# Altium schematic sheet 04_Motor_Driver.SchDoc
size A4; CheckedBy: <审核日期>; Author: llm; CompanyName: 孔乙己图书店; DocumentNumber: 4; SheetNumber: 4; SheetTotal: 6; PageSetup: Record=PageOptions|CenterHorizontal=True|CenterVertical=True|PrintScale=1.00|XCorrection=1.00|YCorrection=1.00|PrintKind=0|BorderSize=5000000|LeftOffset=0|BottomOffset=0|Orientation=2|PaperLength=1000|PaperWidth=1000|Scale=100|PaperSource=7|PrintQuality=600|MediaType=1|DitherType=10|PaperKind=A4|PrintScaleMode=1; DesignDate: <设计日期>; CheckDate: <审核人员>; SheetName: 电机驱动; SheetVersion: Rev.E; SheetDescription: <图纸描述>; productName: Fly-Balance
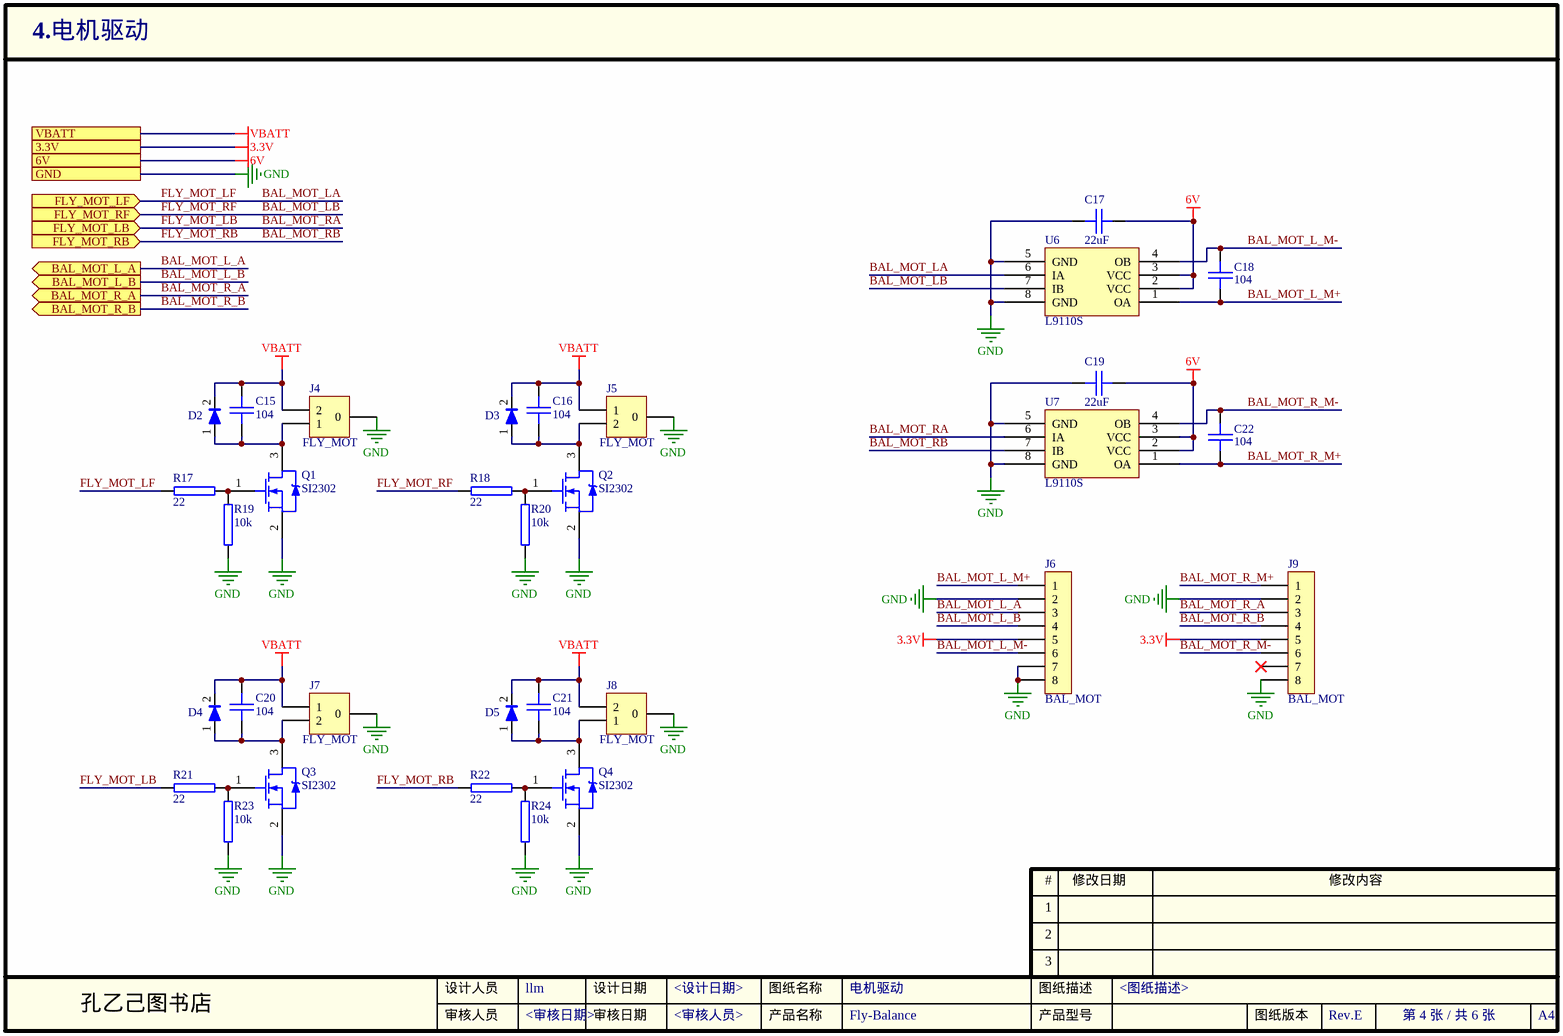
[diagram p0: 04_Motor_Driver.SchDoc]

## Parts
C15  104  [0402C]
C16  104  [0402C]
C17  22uF  [0805C]
C18  104  [0402C]
C19  22uF  [0805C]
C20  104  [0402C]
C21  104  [0402C]
C22  104  [0402C]
D2  1N4001  [SOD-323]  (value not drawn)
D3  1N4001  [SOD-323]  (value not drawn)
D4  1N4001  [SOD-323]  (value not drawn)
D5  1N4001  [SOD-323]  (value not drawn)
J4  FLY_MOT  [CONN-SMD_2P-P1.25]
J5  FLY_MOT  [CONN-SMD_2P-P1.25]
J6  BAL_MOT  [CONN-SMD_6P-P2.00_DEALON_PH-6PWB]
J7  FLY_MOT  [CONN-SMD_2P-P1.25]
J8  FLY_MOT  [CONN-SMD_2P-P1.25]
J9  BAL_MOT  [CONN-SMD_6P-P2.00_DEALON_PH-6PWB]
Q1  SI2302  [SOT-23]
Q2  SI2302  [SOT-23]
Q3  SI2302  [SOT-23]
Q4  SI2302  [SOT-23]
R17  22  [0402R]
R18  22  [0402R]
R19  10k  [0402R]
R20  10k  [0402R]
R21  22  [0402R]
R22  22  [0402R]
R23  10k  [0402R]
R24  10k  [0402R]
U6  L9110S  [SOP-8_L4.9-W3.9-P1.27-LS6.0-BL]
U7  L9110S  [SOP-8_L4.9-W3.9-P1.27-LS6.0-BL]

## Ports
3.3V, 6V, BAL_MOT_L_A (out), BAL_MOT_L_B (out), BAL_MOT_R_A (out), BAL_MOT_R_B (out), FLY_MOT_LB (in), FLY_MOT_LF (in), FLY_MOT_RB (in), FLY_MOT_RF (in), GND, VBATT

## Nets
3.3V: J6.5 J9.5 ; port 3.3V
6V: C17.1 C19.1 U6.2(VCC) U6.3(VCC) U7.2(VCC) U7.3(VCC) ; port 6V
GND: C17.2 C19.2 J4.0 J5.0 J6.2 J6.7 J6.8 J7.0 J8.0 J9.2 J9.8 Q1.2(S) Q2.2(S) Q3.2(S) Q4.2(S) R19.2 R20.2 R23.2 R24.2 U6.5(GND) U6.8(GND) U7.5(GND) U7.8(GND) ; port GND
VBATT: C15.1 C16.1 C20.1 C21.1 D2.2 D3.2 D4.2 D5.2 J4.2 J5.1 J7.1 J8.2 ; port VBATT
BAL_MOT_L_A: J6.3 ; port BAL_MOT_L_A
BAL_MOT_L_B: J6.4 ; port BAL_MOT_L_B
BAL_MOT_L_M+: C18.2 J6.1 U6.1(OA)
BAL_MOT_L_M-: C18.1 J6.6 U6.4(OB)
BAL_MOT_LA: R17.2 U6.6(IA) ; port FLY_MOT_LF  [also labelled FLY_MOT_LF]
BAL_MOT_LB: R18.2 U6.7(IB) ; port FLY_MOT_RF  [also labelled FLY_MOT_RF]
BAL_MOT_R_A: J9.3 ; port BAL_MOT_R_A
BAL_MOT_R_B: J9.4 ; port BAL_MOT_R_B
BAL_MOT_R_M+: C22.2 J9.1 U7.1(OA)
BAL_MOT_R_M-: C22.1 J9.6 U7.4(OB)
BAL_MOT_RA: R21.2 U7.6(IA) ; port FLY_MOT_LB  [also labelled FLY_MOT_LB]
BAL_MOT_RB: R22.2 U7.7(IB) ; port FLY_MOT_RB  [also labelled FLY_MOT_RB]
NetC15_2: C15.2 D2.1 J4.1 Q1.3(D)
NetC16_2: C16.2 D3.1 J5.2 Q2.3(D)
NetC20_2: C20.2 D4.1 J7.2 Q3.3(D)
NetC21_2: C21.2 D5.1 J8.1 Q4.3(D)
NetQ1_1: Q1.1(G) R17.1 R19.1
NetQ2_1: Q2.1(G) R18.1 R20.1
NetQ3_1: Q3.1(G) R21.1 R23.1
NetQ4_1: Q4.1(G) R22.1 R24.1

Not connected (* = marked no-connect by the designer): J9 7*

## Notes on the sheet
- 1
- #
- 修改日期
- 修改内容
- 2
- 3
- 设计人员
- 审核人员
- 设计日期
- 审核日期
- 产品名称
- 图纸名称
- 产品型号
- 图纸描述
- 图纸版本
- A4

## Library data of the parts
C15-C22 = CAP: 电容
D2-D5 = DIODE: 二极管
J4 J5 J7 J8 = CON: 直流电机接口
J6 J9 = CON8: Connector
Q1-Q4 = N-MOS: N-MOSFET
R17-R24 = RES: 电阻
U6 U7 = L9110S: H桥电机驱动芯片